# Altium project DCDC_Converter.PrjPcb
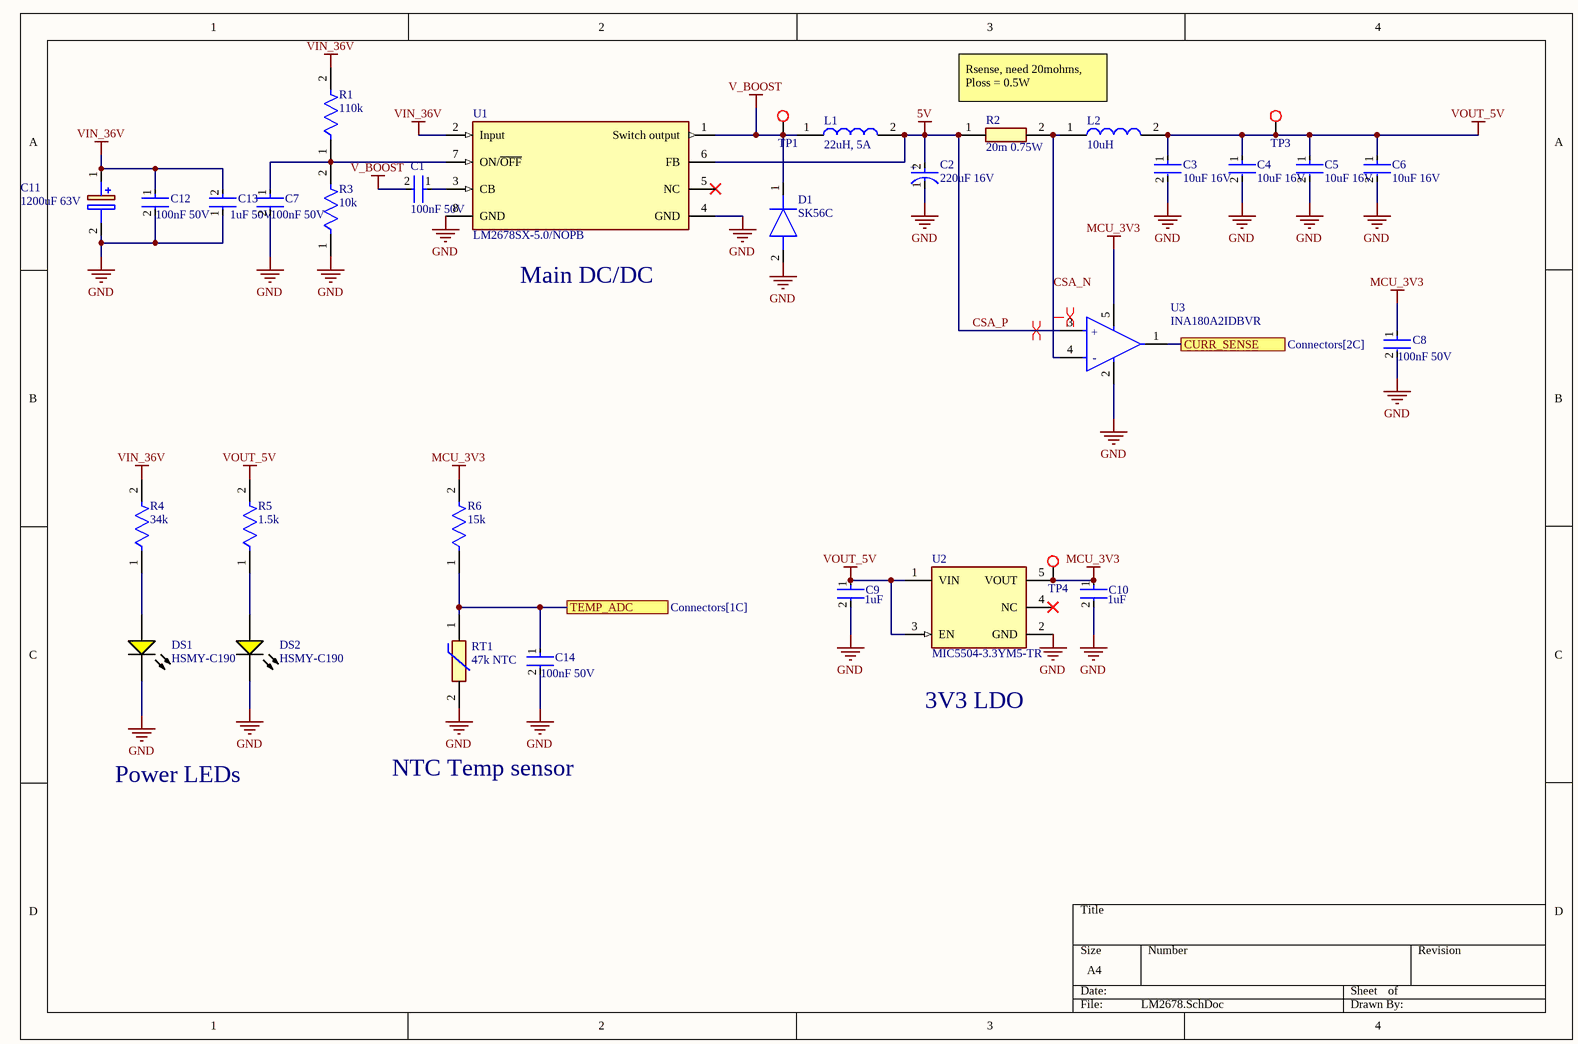
[diagram p0: LM2678.SchDoc]
2 sheets, 87 parts. Net scope: flat (ports and power ports of the same name join across sheets).
Board file: PCB1.PcbDoc
Sheets:
  LM2678.SchDoc
  Connectors.SchDoc

## Sheet LM2678.SchDoc
size A4; SheetNumber: 1; SheetTotal: 2

### Parts
C1  100nF 50V  [FP-CL31-IPC_C]
C2  220uF 16V  [FP-OS-CON-TH-E7-d_0_6-MFG]
C3  10uF 16V  [FP-CL21-IPC_B]
C4  10uF 16V  [FP-CL21-IPC_B]
C5  10uF 16V  [FP-CL21-IPC_B]
C6  10uF 16V  [FP-CL21-IPC_B]
C7  100nF 50V  [FP-CL31-IPC_C]
C8  100nF 50V  [FP-CL31-IPC_C]
C9  1uF  [FP-CL10-IPC_C]
C10  1uF  [FP-CL10-IPC_C]
C11  1200uF 63V  [CAPPRD750W80D1825H3750]
C12  100nF 50V  [FP-CL31-IPC_C]
C13  1uF 50V  [FP-C1608-080-0_1-IPC_B]
C14  100nF 50V  [FP-CL31-IPC_C]
D1  SK56C  [DIOM7959X262N]
DS1  HSMY-C190  [AVAG-HSMX-C190_V]
DS2  HSMY-C190  [AVAG-HSMX-C190_V]
L1  22uH, 5A  [AMRM00101040220MA1]
L2  10uH  [HPC8040NC4R7M]
R1  110k  [FP-RC2012-MFG]
R2  20m 0.75W  [RESC2114X85N]
R3  10k  [FP-MC01W0805-IPC_C]
R4  34k  [FP-CRCW0805-e3-IPC_B]
R5  1.5k  [FP-RC1608-IPC_B]
R6  15k  [FP-CRCW1206-e3-IPC_B]
RT1  47k NTC  [NTCLE100E3473GB0]
TP1  TP  [Testpoint]  (value not drawn)  (no BOM)
TP3  TP  [Testpoint]  (value not drawn)  (no BOM)
TP4  TP  [Testpoint]  (value not drawn)  (no BOM)
U1  LM2678SX-5.0/NOPB  [LM2678SX-5.0/NOPB]
U2  MIC5504-3.3YM5-TR  [FP-SOT23-5LD-PL-1-MFG]
U3  INA180A2IDBVR  [FP-DBV0005A-MFG]

### Ports
CURR_SENSE (see Connectors[2C]), TEMP_ADC (see Connectors[1C])

### Nets
CSA_P: C2.2(A) L1.2 R2.1 U1.6(FB) U3.3(IN+)  [also labelled 5V]
GND: C2.1(C) C3.2 C4.2 C5.2 C6.2 C7.2 C8.2 C9.2 C10.2 C11.2(-) C12.2 C13.1 C14.2 D1.2(A) DS1.2(K) DS2.2(K) R3.1 RT1.2 U1.4(GND) U1.8(GND) U2.2(GND) U3.2(GND)
MCU_3V3: C8.1 C10.1 R6.2 TP4.0 U2.5(VOUT) U3.5(VS)
V_BOOST: C1.2 D1.1(K) L1.1 TP1.0 U1.1(Switch_output)
VIN_36V: C11.1(+) C12.1 C13.2 R1.2 R4.2 U1.2(Input)
VOUT_5V: C3.1 C4.1 C5.1 C6.1 C9.1 L2.2 R5.2 TP3.0 U2.1(VIN) U2.3(EN)
CSA_N: L2.1 R2.2 U3.4(IN-)
NetC1_1: C1.1 U1.3(CB)
NetC7_1: C7.1 R1.1 R3.2 U1.7(ON/~{OFF})
NetC14_1: C14.1 R6.1 RT1.1 ; port TEMP_ADC
NetC15_1: U3.1(OUT) ; port CURR_SENSE
NetDS1_1: DS1.1(A) R4.1
NetDS2_1: DS2.1(A) R5.1

Not connected (* = marked no-connect by the designer): U1 5(NC)*; U2 4(NC)*

### Layout directives
differential pair: CSA_N, CSA_P

### Notes on the sheet
- Rsense, need 20mohms, Ploss = 0.5W
- (near U1) Main DC/DC
- 3V3 LDO
- Power LEDs
- NTC Temp sensor
- (in symbol CMP-04895-000287-1) +; -
- (in symbol CMP-05428-000165-2) +

### Library data of the parts
C1 C7 C8 C12 C14 = CMP-13271-001276-1: Cap Ceramic 100nF 50V X7R ±10% SMD 1206 +125°C Embossed T/R; Dielectric: X7R; Case Code (Metric): 3216; Package Quantity: 1; Thickness: 0.037inch; Depth: 1.6mm; Packaging: Tape and Reel; Capacitance: 100nF; Length: 0.126inch; Tolerance: 10%; Voltage Rating: 50V; Case Code (Imperial): 1206; Radiation Hardening: No; Width: 0.063inch; Case/Package: 1206; Max Operating Temperature: 125°C; Min Operating Temperature: -55°C; Height: 0.85mm; Mount: Surface Mount
C2 = CMP-05428-000165-2: CAP ALUM POLY 220UF 20% 16V T/H; Life (Hours): 5000Hour; Dissipation Factor: 10%; Leakage Current: 500uA; Lead Diameter: 0.6mm; Ripple Current: 4.15A; ESR (Equivalent Series Resistance): 13mR; Polarity: Polar; Reach SVHC Compliant: Yes; Voltage Rating (DC): 16V; Number of Pins: 7; Length: 7mm; Voltage: 16V; Diameter: 8mm; RoHS Compliant: Yes; Max Operating Temperature: 105°C; Height: 7mm; Capacitance: 220uF; Tolerance: 20%; Voltage Rating: 16V; Mount: Through Hole; Series: OS-CON™, SEPC; Packaging: Bulk; Package Quantity: 200; Termination: Radial; Min Operating Temperature: -55°C; Case/Package: Radial; Lead Pitch: 3.5mm; Height - Seated (Max): 0.276inch; Lead Free: Lead Free
C3-C6 = CMP-2000-06102-2: CL21 Series 0805 10uF 16V ±10% Tolerance X5R Multilayer Ceramic Chip Capacitor; Dielectric: X7R; Length: 2mm; Depth: 1.25mm; Voltage: 16V; Width: 0.049inch; Capacitance: 10uF; Lead Free: Lead Free; Max Operating Temperature: 85°C; Mount: Surface Mount; Voltage Rating: 16V; Height: 1.25mm; Radiation Hardening: No; Packaging: Tape and Reel; Voltage Rating (DC): 16V; Thickness: 0.055inch; Case/Package: 0805; Case Code (Imperial): 0805; Min Operating Temperature: -55°C; Case Code (Metric): 2012; Package Quantity: 1; Tolerance: 10%
C9 C10 = CMP-13271-003399-1: Cap Ceramic 1uF 10V X5R ±10% Pad SMD 0603 +85°C T/R; Min Operating Temperature: -55°C; Max Operating Temperature: 85°C; Dielectric: X5R; Contact Plating: Tin; Height: 0.8mm; Voltage: 10V; Packaging: Tape and Reel; Voltage Rating: 10V; Capacitance: 1uF; Package Quantity: 1; Width: 0.031inch; Length: 1.6mm; Depth: 0.8mm; Case/Package: 0603; Case Code (Imperial): 0603; Thickness: 0.035inch; Radiation Hardening: No; Tolerance: 10%; Case Code (Metric): 1608; Mount: Surface Mount
C11 = UHE1J122MHD6: Capacitor Polarised; Manufacturer_Name: Nichicon; Datasheet Link: https://products.nichicon.co.jp/en/pdf/XJA043/e-uhe.pdf; Height: 37.5mm; Manufacturer_Part_Number: UHE1J122MHD6; Mouser Part Number: 647-UHE1J122MHD6; Mouser Price/Stock: https://www.mouser.co.uk/ProductDetail/Nichicon/UHE1J122MHD6?qs=3w7tHOhcdefSsEo8Zd8Pmw%3D%3D; Arrow Part Number: UHE1J122MHD6; Arrow Price/Stock: https://www.arrow.com/en/products/uhe1j122mhd6/nichicon; Supplier 1: Digikey; Supplier Part Number 1: 493-1656-ND
C13 = CMP-2000-06025-2: Multilayer Ceramic Capacitors 1μF ±10% 50V X5R SMD 0603; Lead Free: Lead Free; Height: 0.8mm; Mount: Surface Mount; Radiation Hardening: No; Thickness: 0.035inch; Length: 1.6mm; Max Operating Temperature: 85°C; REACH SVHC: No SVHC; Min Operating Temperature: -55°C; Construction: Flat; RoHS Compliant: Yes; Voltage Rating: 50V; Dielectric: X5R; Packaging: Tape and Reel; Termination: SMD/SMT; Voltage Rating (DC): 50V; Case Code (Imperial): 0603; Voltage: 50V; Width: 0.031inch; Weight: 7.1E-05oz; Capacitance: 1uF; Depth: 0.8mm; Case Code (Metric): 1608; Series: C; Case/Package: 0603; Tolerance: 10%; Resistor Type: Ceramic; Number of Pins: 2; Dielectric Material: Ceramic; Package Quantity: 1
D1 = SK56C: Diode; Manufacturer_Name: Taiwan Semiconductor; Datasheet Link: https://mouser.componentsearchengine.com/Datasheets/2/SK56C.pdf; Height: 2.62mm; Manufacturer_Part_Number: SK56C; Mouser Part Number: 821-SK56C; Mouser Price/Stock: https://www.mouser.co.uk/ProductDetail/Taiwan-Semiconductor/SK56C?qs=tHU%2FlV7kTyQlv9uyXcuY8g%3D%3D
DS1 DS2 = CMP-1744-00003-1: LED Uni-Color Yellow, 65 mW, 20 mA, -40 to 85 degC, 2-Pin SMD, RoHS, Tape and Reel; Tolerance: 1%; Voltage Rating: 50 V; Power Rating: 100 mW; Case\Package: 0603; Resistance: 390 Ohm; Min Operating Temperature: -55 degC; Length: 1.6 mm; ComponentLink3Description: Package Specification; Mount: Surface Mount; PackageReference: HSMX-C190; ComponentLink2Description: Datasheet; DatasheetVersion: Mar-12; Case Code (Metric): 1608; Pins: 2; Package Quantity: 5000; ComponentLink2URL: http://docs.avagotech.com/docs/AV02-0551EN; ComponentLink1Description: Manufacturer URL; RoHSCompliant: true; Packaging: Tape and Reel; PackageDescription: 2-Pin Surface Mount Device, Body 1.6 x 0.8 mm, Height 0.9 mm; REACH SVHC: No SVHC; ComponentLink3URL: http://www.fairchildsemi.com/dwg/MA/MA03D.pdf; Voltage Rating (DC): 50 V; Width: 0.8 mm; ComponentLink1URL: http://www.avagotech.com/; Max Operating Temperature: 155 degC; Case Code (Imperial): 0603; Height: 0.45 mm
L1 = AMRM00101040220MA1: Inductor; Manufacturer_Name: Pulse Electronics; Datasheet Link: https://productfinder.pulseelectronics.com/api/open/part-attachments/datasheet/amrm00101040220ma1; Height: 4mm; Manufacturer_Part_Number: AMRM00101040220MA1; Mouser Part Number: 673-AMRM101040220MA1; Mouser Price/Stock: https://www.mouser.co.uk/ProductDetail/Pulse-Electronics/AMRM00101040220MA1?qs=HoCaDK9Nz5furma8MQ%2FytQ%3D%3D
L2 = HPC8040NC-4R7M: Inductor; Manufacturer_Name: TAI-TECH; Datasheet Link: https://media.digikey.com/pdf/Data%20Sheets/Tai%20Tech%20PDFs/HPC-BM_NF_NCv.pdf; Height: 4.2mm; Manufacturer_Part_Number: HPC8040NC-4R7M; Supplier 1: Digikey; Supplier Part Number 1: 4816-HPC8040NC-100MCT-ND
R1 = CMP-13261-001773-1: Res Thick Film 0805 110kΩ 1% 0.125W ±100ppm/°C Molded SMD T/R; Resistance: 110kR; Max Power Dissipation: 125mW; Voltage Rating (DC): 150V; Packaging: Tape and Reel; Height: 0.024inch; Case/Package: 0805; Composition: Thick Film; Features: Moisture Resistant; Contact Plating: Tin; Military Standard: Not; Case Code (Imperial): 0805; Tolerance: 1%; Width: 0.049inch; Number of Terminations: 2; Lead Free: Lead Free; Min Operating Temperature: -55°C; Radiation Hardening: No; Length: 0.079inch; Depth: 1.25mm; Case Code (Metric): 2012; Temperature Coefficient: 100ppm/°C; Max Operating Temperature: 155°C
R2 = D1WEL0805CR080F-T5: Resistor; Manufacturer_Name: Thin Film Technology Corp.; Datasheet Link: https://mm.digikey.com/Volume0/opasdata/d220001/medias/docus/5732/TFT-DMS-423-1.pdf; Height: 0.85mm; Manufacturer_Part_Number: D1WEL0805CR080F-T5
R3 = CMP-12256-000003-1: Resistor, 10K, 0.1W, 1%, 0805, Reel; Resistance: 10kR; Voltage Rating: 150V; Temperature Coefficient: 100ppm/°C; Power Rating: 100mW; REACH SVHC: No SVHC; Composition: Thick Film; Max Operating Temperature: 155°C; Case/Package: 0805; Tolerance: 1%; Number of Pins: 2; Case Code (Metric): 2012; Voltage Rating (DC): 150V; Min Operating Temperature: -55°C; Width: 1.25mm; Case Code (Imperial): 0805; Packaging: Cut Tape
R4 = CMP-2001-03837-2: RES Thick Film, 34kΩ, 1%, 0.125W, 100ppm/°C, 0805; Resistance: 34kR; Max Power Dissipation: 125mW; Voltage Rating (DC): 150V; Radiation Hardening: No; Case Code (Metric): 2012; Weight: 0.000194oz; Composition: Thick Film; Lead Free: Lead Free; Military Standard: Not; Contact Plating: Tin; Height: 0.02inch; Packaging: Tape and Reel; Depth: 1.25mm; Max Operating Temperature: 155°C; Temperature Coefficient: 100ppm/°C; Width: 0.049inch; Case/Package: 0805; Number of Terminations: 2; Working Voltage: 150V; Power Rating: 125mW; Package Quantity: 10; Min Operating Temperature: -55°C; Termination: SMD/SMT; Features: Automotive AEC-Q200; Tolerance: 1%; Case Code (Imperial): 0805; Voltage Rating: 150V; Length: 2mm
R5 = CMP-13261-004935-1: Res Thick Film 0603 1.5kΩ 1% 0.1W ±100ppm/°C Molded SMD T/R; Resistance: 1.5kR; Voltage Rating (DC): 50V; Power Rating: 100mW; Contact Plating: Tin; Depth: 0.8mm; Width: 800um; Tolerance: 1%; Lead Free: Lead Free; Composition: Thick Film; Military Standard: Not; Temperature Coefficient: 100ppm/°C; Radiation Hardening: No; Length: 1.6mm; Case/Package: 0603; Max Operating Temperature: 155°C; Packaging: Tape and Reel; Min Operating Temperature: -55°C
R6 = CMP-1014-00102-3: RES Thick Film, 15kΩ, 5%, 0.25W, 200ppm/°C, 1206; Max Power Dissipation: 250mW; Voltage Rating (DC): 200V; Resistance: 15kR; Temperature Coefficient: 200ppm/°C; Height: 0.024inch; Case Code (Metric): 3216; Package Quantity: 1; Power Rating: 250mW; Depth: 1.6mm; Lead Free: Lead Free; Features: Automotive AEC-Q200; Width: 1.6mm; Composition: Thick Film; Military Standard: Not; Number of Terminations: 2; Height - Seated (Max): 0.024inch; Radiation Hardening: No; Termination: SMD/SMT; Voltage Rating: 200V; Min Operating Temperature: -55°C; Length: 3.2mm; Tolerance: 5%; Case/Package: 1206; Weight: 0.000353oz; Max Operating Temperature: 155°C; Case Code (Imperial): 1206; Packaging: Tape and Reel; Contact Plating: Tin
RT1 = NTCLE100E3473GB0: Thermistor; Manufacturer_Name: Vishay; Datasheet Link: https://www.vishay.com/docs/29049/ntcle100.pdf; Height: 8mm; Manufacturer_Part_Number: NTCLE100E3473GB0; Mouser Part Number: 594-NTCLE100E3473GB0; Mouser Price/Stock: https://www.mouser.co.uk/ProductDetail/Vishay-BC-Components/NTCLE100E3473GB0?qs=%2FWiulJ9oly60Fl5s5HThvA%3D%3D; Arrow Part Number: NTCLE100E3473GB0; Arrow Price/Stock: https://www.arrow.com/en/products/ntcle100e3473gb0/vishay?region=nac
TP1 TP3 TP4 = Testpoint
U2 = CMP-2000-07604-2: IC REG LINEAR 3.3V 300MA SOT23-5; Quiescent Current: 38uA; Operating Supply Current: 42uA; Max Input Voltage: 5.5V; Min Input Voltage: 2.5V; Output Type: Fixed; Power Supply Rejection Ratio (PSRR): 60dB; Dropout Voltage: 380mV; Accuracy: 3%; Number of Outputs: 1; Nominal Output Voltage: 3.3V; Max Output Current: 300mA; Length: 2.9mm; Mount: Surface Mount; Width: 1.6mm; Packaging: Tape and Reel; Output Current: 300mA; Min Operating Temperature: -40°C; Max Operating Temperature: 125°C; Height: 1.1mm; Case/Package: SOT-23-5; REACH SVHC: No SVHC; Number of Pins: 5; Output Voltage: 3.3V
U3 = CMP-04895-000287-1: IC CURR SENSE 1 CIRCUIT SOT23-5; Operating Supply Current: 260uA; -3db Bandwidth: 350kHz; Slew Rate: 2V/µs; Number of Circuits: 1; Input Offset Voltage (Vos): 100uV; Input Bias Current: 100nA; Mount: Surface Mount; Max Operating Temperature: 125°C; Packaging: Tape and Reel; Min Operating Temperature: -40°C; Case/Package: SOT-23-5; RoHS Compliant: Yes

## Sheet Connectors.SchDoc
size A4; SheetNumber: 2; SheetTotal: 2
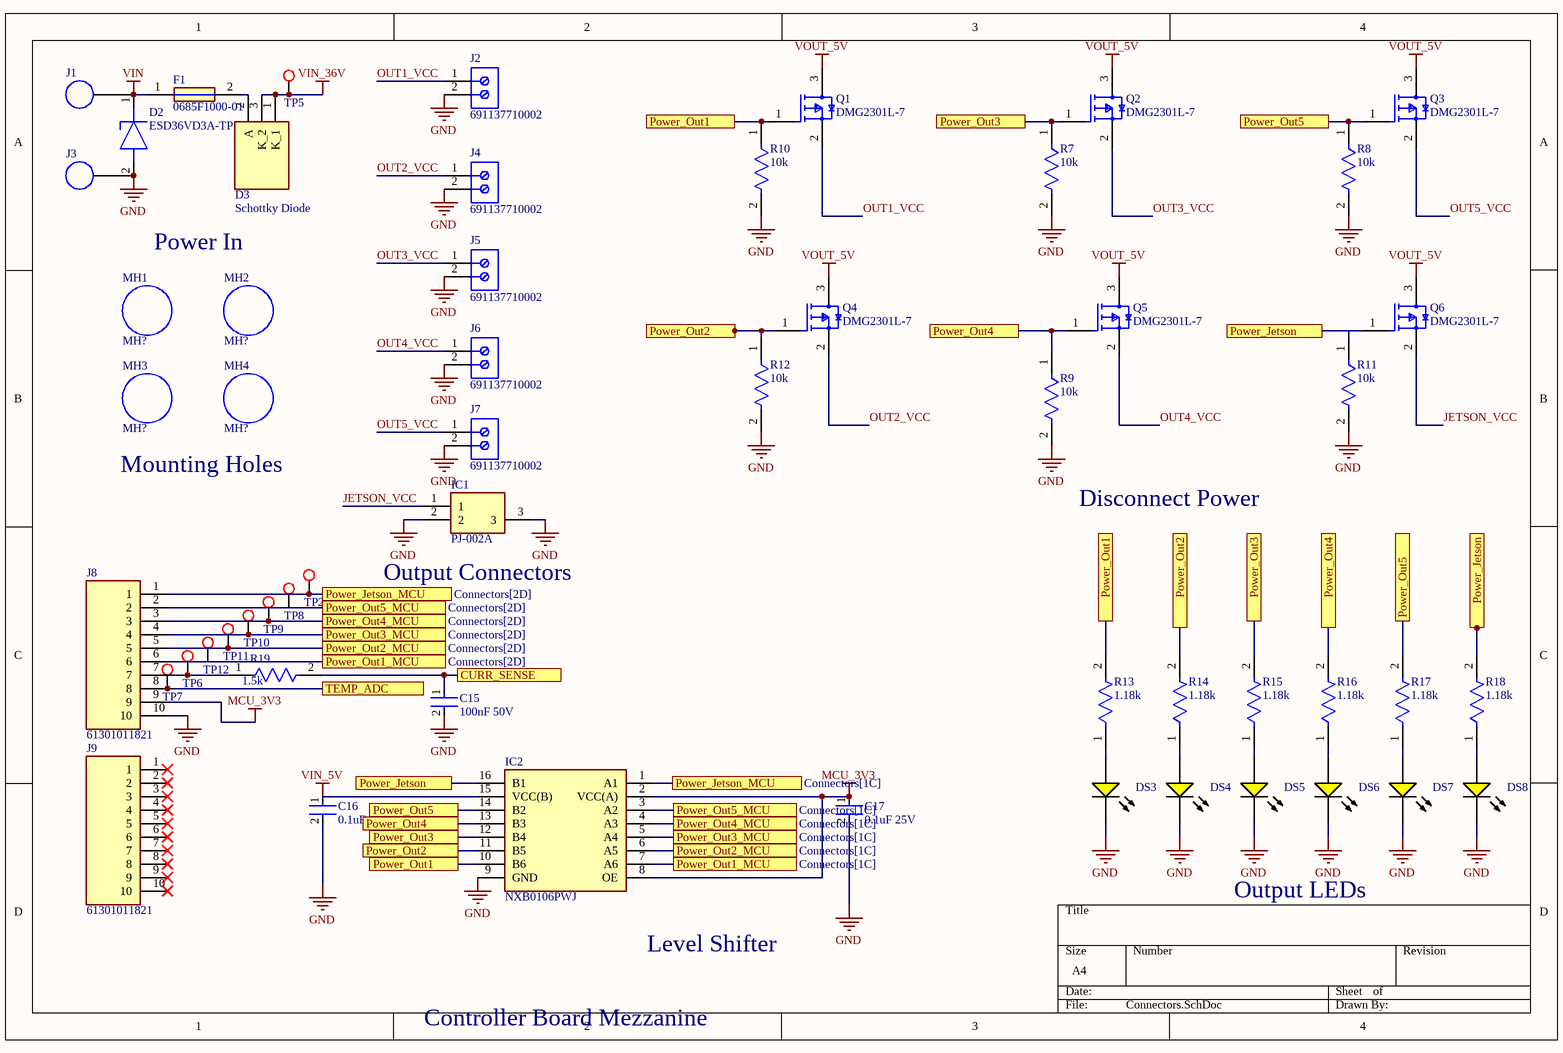
[diagram p1: Connectors.SchDoc]

### Parts
C15  100nF 50V  [FP-CL31-IPC_C]
C16  0.1uF 25V  [FP-CL21-IPC_C]
C17  0.1uF 25V  [FP-CL21-IPC_C]
D2  ESD36VD3A-TP  [SOD2512X115N]
D3  Schottky Diode  [PMEG4010EXEX]
DS3  HSMY-C190  [AVAG-HSMX-C190_V]  (value not drawn)
DS4  HSMY-C190  [AVAG-HSMX-C190_V]  (value not drawn)
DS5  HSMY-C190  [AVAG-HSMX-C190_V]  (value not drawn)
DS6  HSMY-C190  [AVAG-HSMX-C190_V]  (value not drawn)
DS7  HSMY-C190  [AVAG-HSMX-C190_V]  (value not drawn)
DS8  HSMY-C190  [AVAG-HSMX-C190_V]  (value not drawn)
F1  0685F1000-01  [FUSC3216X83N]
IC1  PJ-002A  [PJ002A]
IC2  NXB0106PWJ  [SOP65P640X110-16N]
J1  J?  [Power Screw Terminal]  (value not drawn)  (no BOM)
J2  691137710002  [691137710002]
J3  J?  [Power Screw Terminal]  (value not drawn)  (no BOM)
J4  691137710002  [691137710002]
J5  691137710002  [691137710002]
J6  691137710002  [691137710002]
J7  691137710002  [691137710002]
J8  61301011821  [RHDR10W60P0X254_1X10_2590X250X850P]
J9  61301011821  [RHDR10W60P0X254_1X10_2590X250X850P]
MH1  MH?  [Mounting Hole]  (no BOM)
MH2  MH?  [Mounting Hole]  (no BOM)
MH3  MH?  [Mounting Hole]  (no BOM)
MH4  MH?  [Mounting Hole]  (no BOM)
Q1  DMG2301L-7  [FP-SOT23-MFG]
Q2  DMG2301L-7  [FP-SOT23-MFG]
Q3  DMG2301L-7  [FP-SOT23-MFG]
Q4  DMG2301L-7  [FP-SOT23-MFG]
Q5  DMG2301L-7  [FP-SOT23-MFG]
Q6  DMG2301L-7  [FP-SOT23-MFG]
R7  10k  [FP-MC01W0805-IPC_C]
R8  10k  [FP-MC01W0805-IPC_C]
R9  10k  [FP-MC01W0805-IPC_C]
R10  10k  [FP-MC01W0805-IPC_C]
R11  10k  [FP-MC01W0805-IPC_C]
R12  10k  [FP-MC01W0805-IPC_C]
R13  1.18k  [FP-CPF0603-MFG]
R14  1.18k  [FP-CPF0603-MFG]
R15  1.18k  [FP-CPF0603-MFG]
R16  1.18k  [FP-CPF0603-MFG]
R17  1.18k  [FP-CPF0603-MFG]
R18  1.18k  [FP-CPF0603-MFG]
R19  1.5k  [FP-CRCW0603-e3-IPC_A]
TP2  TP  [Testpoint]  (value not drawn)
TP5  TP  [Testpoint]  (value not drawn)
TP6  TP  [Testpoint]  (value not drawn)
TP7  TP  [Testpoint]  (value not drawn)
TP8  TP  [Testpoint]  (value not drawn)
TP9  TP  [Testpoint]  (value not drawn)
TP10  TP  [Testpoint]  (value not drawn)
TP11  TP  [Testpoint]  (value not drawn)
TP12  TP  [Testpoint]  (value not drawn)

### Ports
CURR_SENSE (see LM2678[3B]), Power_Jetson (see Connectors[1D], Connectors[4B]), Power_Jetson (see Connectors[1D], Connectors[4C]), Power_Jetson (see Connectors[4B], Connectors[4C]), Power_Jetson_MCU (see Connectors[1C]), Power_Jetson_MCU (see Connectors[2D]), Power_Out1 (see Connectors[1D], Connectors[2A]), Power_Out1 (see Connectors[1D], Connectors[3C]), Power_Out1 (see Connectors[2A], Connectors[3C]), Power_Out1_MCU (see Connectors[1C]), Power_Out1_MCU (see Connectors[2D]), Power_Out2 (see Connectors[1D], Connectors[2B]), Power_Out2 (see Connectors[1D], Connectors[4C]), Power_Out2 (see Connectors[2B], Connectors[4C]), Power_Out2_MCU (see Connectors[1C]), Power_Out2_MCU (see Connectors[2D]), Power_Out3 (see Connectors[1D], Connectors[3A]), Power_Out3 (see Connectors[1D], Connectors[4C]), Power_Out3 (see Connectors[3A], Connectors[4C]), Power_Out3_MCU (see Connectors[1C]), Power_Out3_MCU (see Connectors[2D]), Power_Out4 (see Connectors[1D], Connectors[3B]), Power_Out4 (see Connectors[1D], Connectors[4C]), Power_Out4 (see Connectors[3B], Connectors[4C]), Power_Out4_MCU (see Connectors[1C]), Power_Out4_MCU (see Connectors[2D]), Power_Out5 (see Connectors[1D], Connectors[4A]), Power_Out5 (see Connectors[1D], Connectors[4C]), Power_Out5 (see Connectors[4A], Connectors[4C]), Power_Out5_MCU (see Connectors[1C]), Power_Out5_MCU (see Connectors[2D]), TEMP_ADC (see LM2678[2C])

### Nets
GND: C15.2 C16.2 C17.2 D2.2(A) DS3.2(K) DS4.2(K) DS5.2(K) DS6.2(K) DS7.2(K) DS8.2(K) IC1.2 IC1.3 IC2.9(GND) J2.2 J3.1 J4.2 J5.2 J6.2 J7.2 J8.10 R7.2 R8.2 R9.2 R10.2 R11.2 R12.2
MCU_3V3: C17.1 IC2.2(VCC(A)) IC2.8(OE) J8.9
VIN: D2.1(K) F1.1 J1.1
VIN_5V: C16.1 IC2.15(VCC(B))
VIN_36V: D3.1(K_1) D3.3(K_2) TP5.0
VOUT_5V: Q1.3(D) Q2.3(D) Q3.3(D) Q4.3(D) Q5.3(D) Q6.3(D)
JETSON_VCC: IC1.1 Q6.2(S)
OUT1_VCC: J2.1 Q1.2(S)
OUT2_VCC: J4.1 Q4.2(S)
OUT3_VCC: J5.1 Q2.2(S)
OUT4_VCC: J6.1 Q5.2(S)
OUT5_VCC: J7.1 Q3.2(S)
NetC14_1: J8.8 TP7.0 ; port TEMP_ADC
NetC15_1: C15.1 R19.2 ; port CURR_SENSE
NetD3_2: D3.2(A) F1.2
NetDS3_1: DS3.1(A) R13.1
NetDS4_1: DS4.1(A) R14.1
NetDS5_1: DS5.1(A) R15.1
NetDS6_1: DS6.1(A) R16.1
NetDS7_1: DS7.1(A) R17.1
NetDS8_1: DS8.1(A) R18.1
NetIC2_1: IC2.1(A1) J8.1 TP2.0 ; port Power_Jetson_MCU
NetIC2_3: IC2.3(A2) J8.2 TP8.0 ; port Power_Out5_MCU
NetIC2_4: IC2.4(A3) J8.3 TP9.0 ; port Power_Out4_MCU
NetIC2_5: IC2.5(A4) J8.4 TP10.0 ; port Power_Out3_MCU
NetIC2_6: IC2.6(A5) J8.5 TP11.0 ; port Power_Out2_MCU
NetIC2_7: IC2.7(A6) J8.6 TP12.0 ; port Power_Out1_MCU
NetIC2_10: IC2.10(B6) Q1.1(G) R10.1 R13.2 ; port Power_Out1
NetIC2_11: IC2.11(B5) Q4.1(G) R12.1 R14.2 ; port Power_Out2
NetIC2_12: IC2.12(B4) Q2.1(G) R7.1 R15.2 ; port Power_Out3
NetIC2_13: IC2.13(B3) Q5.1(G) R9.1 R16.2 ; port Power_Out4
NetIC2_14: IC2.14(B2) Q3.1(G) R8.1 R17.2 ; port Power_Out5
NetIC2_16: IC2.16(B1) Q6.1(G) R11.1 R18.2 ; port Power_Jetson
NetJ8_7: J8.7 R19.1 TP6.0

Not connected (* = marked no-connect by the designer): J9 1* 2* 3* 4* 5* 6* 7* 8* 9* 10*

### Notes on the sheet
- Power In
- Mounting Holes
- Disconnect Power
- (near IC1) Output Connectors
- Output LEDs
- Level Shifter
- Controller Board Mezzanine

### Library data of the parts
C15 = CMP-13271-001276-1: as C1 on sheet LM2678; Dielectric: X7R; Case Code (Metric): 3216; Package Quantity: 1; Thickness: 0.037inch; Depth: 1.6mm; Packaging: Tape and Reel; Capacitance: 100nF; Length: 0.126inch; Tolerance: 10%; Voltage Rating: 50V; Case Code (Imperial): 1206; Radiation Hardening: No; Width: 0.063inch; Case/Package: 1206; Max Operating Temperature: 125°C; Min Operating Temperature: -55°C; Height: 0.85mm; Mount: Surface Mount
C16 C17 = CMP-13271-002094-1: CL21 Series 0805 100nF 25V -20/+80% Tolerance Y5V Multilayer Ceramic Chip Capacitor; Tolerance: 80%; Case/Package: 0805; Width: 0.049inch; Mount: Surface Mount; Packaging: Tape and Reel; Dielectric: Y5V; Voltage Rating (DC): 25V; Thickness: 0.03inch; Lead Free: Lead Free; Package Quantity: 1; Max Operating Temperature: 85°C; Case Code (Imperial): 0805; Min Operating Temperature: -30°C; Length: 2mm; Height: 0.65mm; Radiation Hardening: No; Depth: 1.25mm; Capacitance: 100nF; Case Code (Metric): 2012; Voltage Rating: 25V
D2 = ESD36VD3A-TP: Diode ESD (Uni-directional); Manufacturer_Name: MCC; Datasheet Link: https://www.mccsemi.com/pdf/Products/ESD3V3D3A_ESD36VD3A(SOD-323).pdf; Height: 1.15mm; Manufacturer_Part_Number: ESD36VD3A-TP
D3 = PMEG6010EXEX: Manufacturer_Name: Nexperia; Datasheet Link: https://assets.nexperia.com/documents/data-sheet/PMEG4010EXE.pdf; Height: 1mm; Manufacturer_Part_Number: PMEG6010EXEX
DS3-DS8 = CMP-1744-00003-1: as DS1 on sheet LM2678; Min Operating Temperature: -55 degC; Length: 1.6 mm; ComponentLink3Description: Package Specification; Mount: Surface Mount; PackageReference: HSMX-C190; ComponentLink2Description: Datasheet; DatasheetVersion: Mar-12; Case Code (Metric): 1608; Pins: 2; Package Quantity: 5000; ComponentLink2URL: http://docs.avagotech.com/docs/AV02-0551EN; ComponentLink1Description: Manufacturer URL; RoHSCompliant: true; Packaging: Tape and Reel; PackageDescription: 2-Pin Surface Mount Device, Body 1.6 x 0.8 mm, Height 0.9 mm; REACH SVHC: No SVHC; ComponentLink3URL: http://www.fairchildsemi.com/dwg/MA/MA03D.pdf; Voltage Rating (DC): 50 V; Width: 0.8 mm; ComponentLink1URL: http://www.avagotech.com/; Max Operating Temperature: 155 degC; Case Code (Imperial): 0603; Height: 0.45 mm
F1 = 0685F1000-01: Fuse; Manufacturer_Name: Bel Circuit Protection; Datasheet Link: https://componentsearchengine.com/Datasheets/2/0685F1000-01.pdf; Height: 0.83mm; Manufacturer_Part_Number: 0685F1000-01; Supplier 1: Newark; Supplier Part Number 1: 48AC8477
IC1 = PJ-002A: Integrated Circuit; Manufacturer_Name: Same Sky; Datasheet Link: https://www.cui.com/product/resource/digikeypdf/pj-002a.pdf; Height: 11mm; Manufacturer_Part_Number: PJ-002A; Mouser Part Number: 490-PJ-002A; Mouser Price/Stock: https://www.mouser.co.uk/ProductDetail/CUI-Devices/PJ-002A?qs=WyjlAZoYn51CKfAix9Mngw%3D%3D; Arrow Part Number: PJ-002A; Arrow Price/Stock: https://www.arrow.com/en/products/pj-002a/cui-devices?utm_currency=USD&region=europe
IC2 = NXB0106PWJ: Integrated Circuit; Manufacturer_Name: Nexperia; Datasheet Link: https://assets.nexperia.com/documents/data-sheet/NXB0106.pdf; Height: 1.1mm; Manufacturer_Part_Number: NXB0106PWJ; Mouser Part Number: 771-NXB0106PWJ; Mouser Price/Stock: https://www.mouser.co.uk/ProductDetail/Nexperia/NXB0106PWJ?qs=HoCaDK9Nz5faiIwxolisWw%3D%3D; Arrow Part Number: NXB0106PWJ; Arrow Price/Stock: https://www.arrow.com/en/products/nxb0106pwj/nexperia?utm_currency=USD&region=nac
J1 J3 = Screw Connector
J2 J4-J7 = CMP-1502-03324-2: NexarPartId: 78871135; Voltage Rating: 300V; Number of Contacts: 2; Current Rating: 16A; Lead Pitch: 5mm; Height: 11.6mm; Packaging: Box; RoHS: Non-Compliant; Contact Material: Nickel, Tin; Max Operating Temperature: 120°C; Number of Pins: 2; Min Operating Temperature: -30°C; Number of Rows: 1
J8 J9 = 61301011821: Connector; Manufacturer_Name: Wurth Elektronik; Datasheet Link: http://katalog.we-online.de/em/datasheet/6130xx11821.pdf; Height: 8.5mm; Manufacturer_Part_Number: 61301011821; Mouser Part Number: 710-61301011821; Mouser Price/Stock: https://www.mouser.co.uk/ProductDetail/Wurth-Elektronik/61301011821?qs=W%252B2sBeLta1ZhlLR0YCzonQ%3D%3D
MH1-MH4 = Mounting Hole
Q1-Q6 = CMP-12801-000065-1: MOSFET P-CH 20V 3A SOT23; Manufacturer: Diodes Inc.; Number Of Channels: 1; Turn On Delay Time: 5ns; Drain To Source Resistance: 120mΩ; Max Junction Temp: +150°C; Gate To Source Voltage: 8V; Power Dissipation: 1.5W; Rthja Max: 83°C/W; Max Forward Diode Voltage: -1.2V; Standoff Height: 0.013mm; Threshold Vgs Min: -0.4V; Input Capacitace At Vds: 476pF @ -10V; Depletion Mode: False; Gate Charge At Vgs: 5.5nC @ -4.5V; Pulse Drain Current: -10A; Drain To Source Voltage: -20V; Continuous Drain Current: -3A; Turn Off Delay Time: 30ns; Lead Free: Yes; Package: SOT23; ComponentLink2Description: Datasheet; Device Class L3: MOSFETs; Device Class L1: Discrete Semiconductors; Manufacturer Part Number: DMG2301L-7; Automotive: No; Height: 1.1mm; Category: Trans; Temperature Range High: +150°C; Digikey Description: MOSFET P-CH 20V 3A SOT23; RoHS: TRUE; Number Of P Channels: 1; Footprint Url: https://www.diodes.com/assets/Package-Files/SOT23.pdf; Octopart: https://octopart.com/dmg2301l-7-diodes+inc.-67250456; ComponentLink2URL: https://www.diodes.com/assets/Datasheets/DMG2301L.pdf; Mouser Description: Single P-Channel 20 V 1.5 W 5.5 nC Silicon Surface Mount Mosfet - SOT-23; Drain To Source Breakdown Voltage: -20V; Threshold Vgs Max: -1.2V; Device Class L2: Transistors; Temperature: -55°C to +150°C; Temperature Range Low: -55°C
R7-R12 = CMP-12256-000003-1: as R3 on sheet LM2678; REACH SVHC: No SVHC; Composition: Thick Film; Max Operating Temperature: 155°C; Case/Package: 0805; Tolerance: 1%; Number of Pins: 2; Case Code (Metric): 2012; Voltage Rating (DC): 150V; Min Operating Temperature: -55°C; Width: 1.25mm; Case Code (Imperial): 0805; Packaging: Cut Tape
R13-R18 = CMP-03211-006385-1: RES SMD 1.18KΩ 1% 1/16W 0603; Manufacturer: TE Connectivity; Manufacturer Part Number: CPF0603F1K18C1; Voltage Rating: 50V; Power Rating: 0.063W; Temperature Coefficient: 50ppm/°C; Octopart: https://octopart.com/cpf0603f1k18c1-te+connectivity-7514649; ComponentLink2URL: https://www.te.com/commerce/DocumentDelivery/DDEController?Action=showdoc&DocId=Data+Sheet%7F1773200%7FM%7Fpdf%7FEnglish%7FENG_DS_1773200_M.pdf%7F3-1676481-2; Automotive: No; Ipc Land Pattern Name: RESC15580X45; octopart_url: https://octopart.com/cpf0603f1k18c1-te+connectivity-7514649; Tolerance: 1%; Device Class L1: Passive Components; Height: 0.55mm; RoHS: TRUE; Temperature Range Low: -55°C; Series: CPF; Lead Free: Yes; packaging: 1k Reel; Package: CPF0603; Temperature Range High: +155°C; Value: 1.18KΩ; Category: Res; Temperature: -55°C to +155°C; Composition: Thin Film; Device Class L3: Chip SMD Resistors; ComponentLink2Description: Datasheet; Device Class L2: Resistors; Resistance: 1.18KΩ
R19 = CMP-2000-02995-2: RES Thick Film, 1.5kΩ, 1%, 0.1W, 100ppm/°C, 0603; Working Voltage: 75V; Power Rating: 100mW; Resistance: 1.5kR; Max Operating Temperature: 155°C; Features: Automotive AEC-Q200; Min Operating Temperature: -55°C; Width: 0.033inch; Case/Package: 0603; Voltage Rating (DC): 75V; Termination: SMD/SMT; Mount: Surface Mount; Weight: 7.1E-05oz; Case Code (Metric): 1608; Height: 0.45mm; Voltage Rating: 75V; Length: 1.55mm; Package Quantity: 10; Lead Free: Lead Free; Composition: Thick Film; Packaging: Tape and Reel; Temperature Coefficient: 100ppm/°C; Tolerance: 1%; Military Standard: Not; Case Code (Imperial): 0603; Number of Terminations: 2; Max Power Dissipation: 100mW; Depth: 0.85mm; Contact Plating: Tin
TP2 TP5-TP12 = Testpoint

## Nets that join several sheets
GND: LM2678 (22 pins), Connectors (26 pins)
MCU_3V3: LM2678 (6 pins), Connectors (C17.1 IC2.2 IC2.8 J8.9)
VIN_36V: LM2678 (6 pins), Connectors (D3.1 D3.3 TP5.0)
VOUT_5V: LM2678 (10 pins), Connectors (6 pins)
NetC14_1: LM2678 (C14.1 R6.1 RT1.1), Connectors (J8.8 TP7.0)
NetC15_1: LM2678 (U3.1), Connectors (C15.1 R19.2)